# EAGLE design new_ATmega1280_breakout_smaller (EAGLE 5.11)
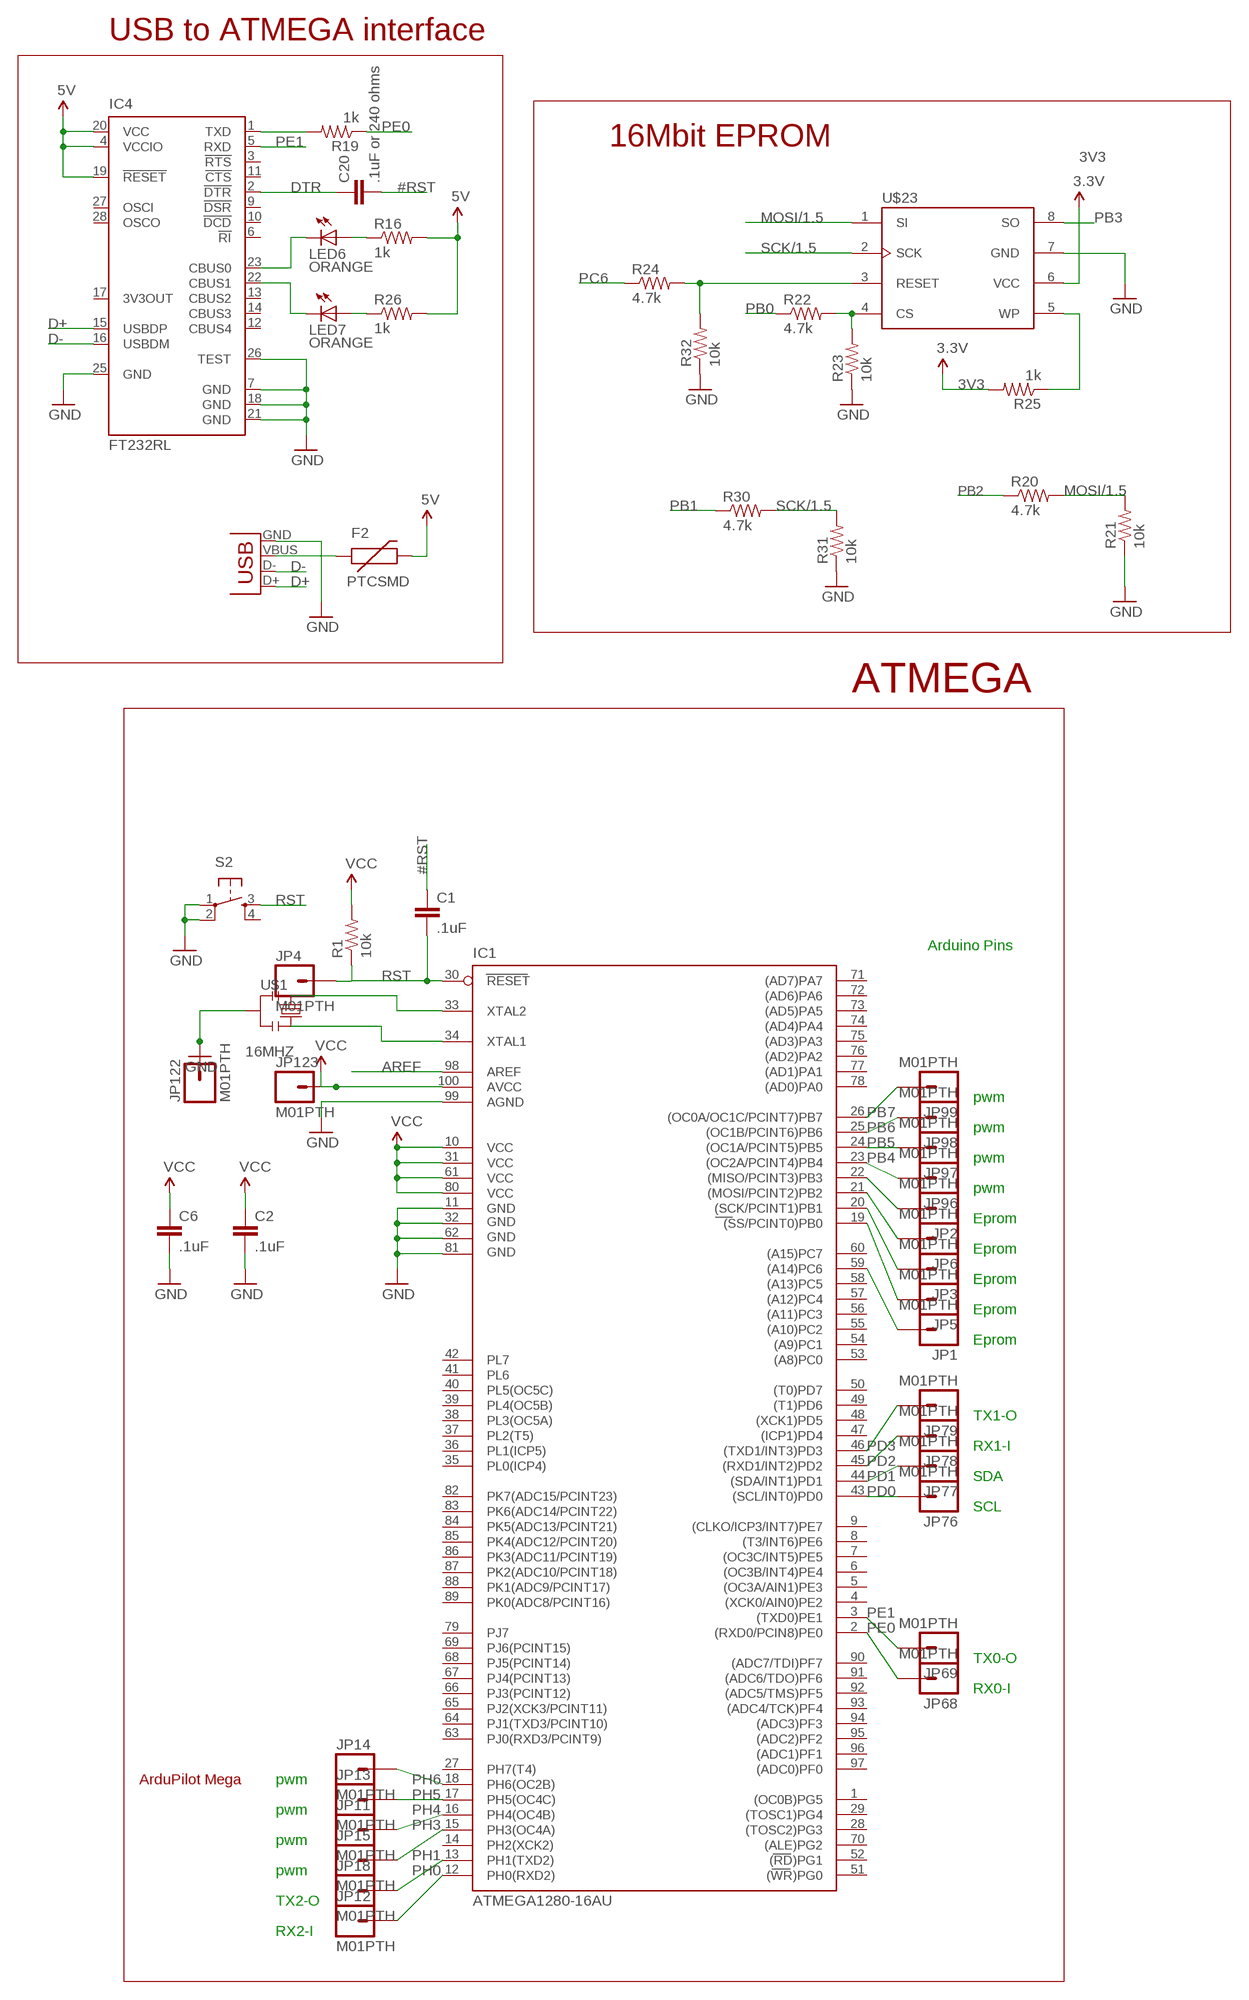
[diagram p0: schematic, sheet 1]

## Parts
C1  .1uF  CAP0402  [C0402]
C2  .1uF  CAP0402  [C0402]
C6  .1uF  CAP0402  [C0402]
C20  .1uF or 240 ohms  CAP0402  [C0402]
F2  PTCSMD  [PTC-1206]
IC1  ATMEGA1280-16AU  [TQFP100]
IC4  FT232RL  [SSOP28]
JP1  M01PTH  [1X01]
JP2  M01PTH  [1X01]
JP3  M01PTH  [1X01]
JP4  M01PTH  [1X01]
JP5  M01PTH  [1X01]
JP6  M01PTH  [1X01]
JP11  M01PTH  [1X01]
JP12  M01PTH  [1X01]
JP13  M01PTH  [1X01]
JP14  M01PTH  [1X01]
JP15  M01PTH  [1X01]
JP18  M01PTH  [1X01]
JP68  M01PTH  [1X01]
JP69  M01PTH  [1X01]
JP76  M01PTH  [1X01]
JP77  M01PTH  [1X01]
JP78  M01PTH  [1X01]
JP79  M01PTH  [1X01]
JP96  M01PTH  [1X01]
JP97  M01PTH  [1X01]
JP98  M01PTH  [1X01]
JP99  M01PTH  [1X01]
JP122  M01PTH  [1X01]
JP123  M01PTH  [1X01]
LED6  ORANGE  LED0603  [LED-0603]
LED7  ORANGE  LED0603  [LED-0603]
R1  10k  RESISTOR0402  [C0402]
R16  1k  RESISTOR0402  [C0402]
R19  1k  RESISTOR0402  [C0402]
R20  4.7k  RESISTOR0402  [C0402]
R21  10k  RESISTOR0402  [C0402]
R22  4.7k  RESISTOR0402  [C0402]
R23  10k  RESISTOR0402  [C0402]
R24  4.7k  RESISTOR0402  [C0402]
R25  1k  RESISTOR0402  [C0402]
R26  1k  RESISTOR0402  [C0402]
R30  4.7k  RESISTOR0402  [C0402]
R31  10k  RESISTOR0402  [C0402]
R32  10k  RESISTOR0402  [C0402]
S2  TAC_SWITCHSMD  [TACTILE_SWITCH_SMD]
U$1  16MHZ  RESONATORSMD  [RESONATOR-SMD]
U$23  DF  ATMEL_DATA_FLASH  [SO08WIDE]
X1  USBSMD  [USB-MINIB]

## Nets
3V3: R25.2 U$23.6(VCC) ; supply symbol labelled 3.3V
5V: F2.2
#RST: C1.1 C20.2
AREF: IC1.98(AREF)
D+: IC4.15(USBDP) X1.D+
D-: IC4.16(USBDM) X1.D-
DTR: C20.1 IC4.2(!DTR)
GND: C2.2 C6.2 IC1.11(GND) IC1.32(GND1) IC1.62(GND2) IC1.81(GND3) IC1.99(AGND) IC4.7(GND) IC4.18(GND) IC4.21(GND) IC4.25(GND) IC4.26(TEST) JP122.1 R21.1 R23.1 R31.1 R32.1 S2.1 S2.2 U$1.2 U$23.7(GND) X1.GND
MOSI/1.5: R20.2 R21.2 U$23.1(SI)
N$15: LED6.A R16.1
N$16: IC4.1(TXD) R19.2
N$17: F2.1 X1.VBUS
N$18: R22.2 R23.2 U$23.4(CS)
N$19: R24.2 R32.2 U$23.3(RESET)
N$22: LED7.A R26.1
N$24: IC4.23(CBUS0) LED6.C
N$25: IC4.22(CBUS1) LED7.C
N$56: IC1.34(XTAL1) U$1.3
N$89: IC1.33(XTAL2) U$1.1
PB0: IC1.19((SS/PCINT0)PB0) JP5.1 R22.1
PB1: IC1.20((SCK/PCINT1)PB1) JP3.1 R30.1
PB2: IC1.21((MOSI/PCINT2)PB2) JP6.1 R20.1
PB3: IC1.22((MISO/PCINT3)PB3) JP2.1 U$23.8(SO)
PB4: IC1.23((OC2A/PCINT4)PB4) JP96.1
PB5: IC1.24((OC1A/PCINT5)PB5) JP97.1
PB6: IC1.25((OC1B/PCINT6)PB6) JP98.1
PB7: IC1.26((OC0A/OC1C/PCINT7)PB7) JP99.1
PC6: IC1.59((A14)PC6) JP1.1 R24.1
PD0: IC1.43((SCL/INT0)PD0) JP76.1
PD1: IC1.44((SDA/INT1)PD1) JP77.1
PD2: IC1.45((RXD1/INT2)PD2) JP78.1
PD3: IC1.46((TXD1/INT3)PD3) JP79.1
PE0: IC1.2((RXD0/PCIN8)PE0) JP68.1 R19.1
PE1: IC1.3((TXD0)PE1) IC4.5(RXD) JP69.1
PH0: IC1.12(PH0(RXD2)) JP12.1
PH1: IC1.13(PH1(TXD2)) JP18.1
PH3: IC1.15(PH3(OC4A)) JP15.1
PH4: IC1.16(PH4(OC4B)) JP11.1
PH5: IC1.17(PH5(OC4C)) JP13.1
PH6: IC1.18(PH6(OC2B)) JP14.1
RST: C1.2 IC1.30(RESET) JP4.1 R1.1 S2.3
SCK/1.5: R30.2 R31.2 U$23.2(SCK)
VCC: C2.1 C6.1 IC1.10(VCC) IC1.31(VCC1) IC1.61(VCC2) IC1.80(VCC3) IC1.100(AVCC) IC4.4(VCCIO) IC4.19(!RESET) IC4.20(VCC) JP123.1 R1.2 R16.2 R26.2 ; supply symbol labelled 5V
WP: R25.1 U$23.5(WP)
Unconnected: IC1.1((OC0B)PG5) IC1.4((XCK0/AIN0)PE2) IC1.5((OC3A/AIN1)PE3) IC1.6((OC3B/INT4)PE4) IC1.7((OC3C/INT5)PE5) IC1.8((T3/INT6)PE6) IC1.9((CLKO/ICP3/INT7)PE7) IC1.14(PH2(XCK2)) IC1.27(PH7(T4)) IC1.28((TOSC2)PG3) IC1.29((TOSC1)PG4) IC1.35(PL0(ICP4)) IC1.36(PL1(ICP5)) IC1.37(PL2(T5)) IC1.38(PL3(OC5A)) IC1.39(PL4(OC5B)) IC1.40(PL5(OC5C)) IC1.41(PL6) IC1.42(PL7) IC1.47((ICP1)PD4) IC1.48((XCK1)PD5) IC1.49((T1)PD6) IC1.50((T0)PD7) IC1.51((WR)PG0) IC1.52((RD)PG1) IC1.53((A8)PC0) IC1.54((A9)PC1) IC1.55((A10)PC2) IC1.56((A11)PC3) IC1.57((A12)PC4) IC1.58((A13)PC5) IC1.60((A15)PC7) IC1.63(PJ0(RXD3/PCINT9)) IC1.64(PJ1(TXD3/PCINT10)) IC1.65(PJ2(XCK3/PCINT11)) IC1.66(PJ3(PCINT12)) IC1.67(PJ4(PCINT13)) IC1.68(PJ5(PCINT14)) IC1.69(PJ6(PCINT15)) IC1.70((ALE)PG2) IC1.71((AD7)PA7) IC1.72((AD6)PA6) IC1.73((AD5)PA5) IC1.74((AD4)PA4) IC1.75((AD3)PA3) IC1.76((AD2)PA2) IC1.77((AD1)PA1) IC1.78((AD0)PA0) IC1.79(PJ7) IC1.82(PK7(ADC15/PCINT23)) IC1.83(PK6(ADC14/PCINT22)) IC1.84(PK5(ADC13/PCINT21)) IC1.85(PK4(ADC12/PCINT20)) IC1.86(PK3(ADC11/PCINT19)) IC1.87(PK2(ADC10/PCINT18)) IC1.88(PK1(ADC9/PCINT17)) IC1.89(PK0(ADC8/PCINT16)) IC1.90((ADC7/TDI)PF7) IC1.91((ADC6/TDO)PF6) IC1.92((ADC5/TMS)PF5) IC1.93((ADC4/TCK)PF4) IC1.94((ADC3)PF3) IC1.95((ADC2)PF2) IC1.96((ADC1)PF1) IC1.97((ADC0)PF0) IC4.3(!RTS) IC4.6(!RI) IC4.9(!DSR) IC4.10(!DCD) IC4.11(!CTS) IC4.12(CBUS4) IC4.13(CBUS2) IC4.14(CBUS3) IC4.17(3V3OUT) IC4.27(OSCI) IC4.28(OSCO) S2.4

## Notes on the sheet
- USB to ATMEGA interface
- 16Mbit EPROM
- ATMEGA
- Arduino Pins
- pwm
- pwm
- pwm
- pwm
- Eprom
- Eprom
- Eprom
- Eprom
- Eprom
- TX1-O
- RX1-I
- SDA
- SCL
- TX0-O
- RX0-I
- ArduPilot Mega | pwm
- pwm
- pwm
- pwm
- TX2-O
- RX2-I

## Library data of the parts
C1 C2 C6 C20 = DIYdrones3:CAP: Capacitor Standard 0603 ceramic capacitor, and 0.1" leaded capacitor.
F2 = DIYdrones3:PTC: Resettable Fuse PTC Resettable Fuse. Spark Fun Electronics SKU : COM-08357
IC1 = atmel-2010:ATMEGA*: MICROCONTROLLER 64/128/256 Kbytes FLASH 4 Kbytes EEPROM 8 Kbytes SRAM 86 General Purpose I/O pins 12-channels16-bit PWM 4 x Serial USARTs 16-channels 10-bit A/D
IC4 = ftdichip:FT232R: Source: http://www.ftdichip.com/Documents/DataSheets/DS_FT232R_v104.pdf
JP1-JP6 JP11-JP15 JP18 JP68 JP69 JP76-JP79 JP96-JP99 JP122 JP123 = DIYdrones3:M01: Header 1 Standard 1-pin 0.1" header. Use with straight break away headers (SKU : PRT-00116), right angle break away headers (PRT-00553), swiss pins (PRT-00743), machine pins (PRT-00117), and female headers (PRT-00115).
LED6 LED7 = DIYdrones3:LED: LEDs Standard schematic elements and footprints for 5mm, 3mm, 1206, and 0603 sized LEDs. 5mm - Spark Fun Electronics SKU : COM-00529 (and others)
R1 R16 R19-R26 R30-R32 = DIYdrones3:RESISTOR: Resistor Basic schematic elements and footprints for 0603, 1206, and PTH 1/10th watt (small) resistors.
S2 = SparkFun:TAC_SWITCH: Momentary Switch Button commonly used for reset or general input. Spark Fun Electronics SKU : COM-00097
U$1 = DIYdrones3:RESONATOR: Resonator Small SMD resonator. This is the itty bitty 10/20MHz resonators with built in caps. CSTCE10M0G55 and CSTCE20M0V53. Footprint has been reviewed closely but hasn't been tested yet.
U$23 = DIYdrones3:ATMEL_DATA_FLASH: 16Mbit EEPROM DataFlash Footprint needs touching up. Spark Fun Electronics SKU : COM-00301
X1 = DIYdrones3:USB: USB Connectors USB-B-PTH is fully proven SKU : PRT-00139 USB-miniB is fully proven SKU : PRT-00587 USB-A-PCB is untested. USB-A-H is throughly reviewed, but untested. Spark Fun Electronics SKU : PRT-00437 USB-B-SMT is throughly reviewed, but untested. Needs silkscreen touching up. USB-A-S has not been used/tested USB-MB-H has not been used/tested

## Board
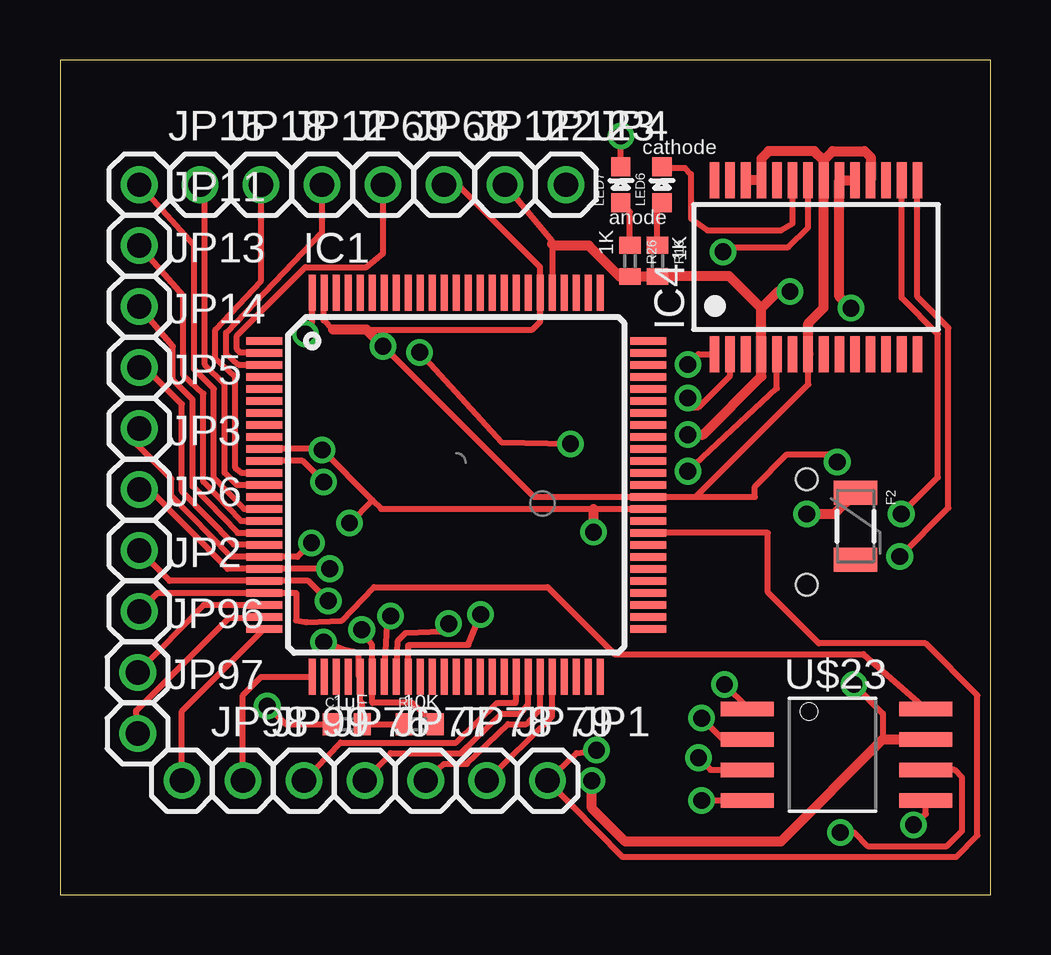
[diagram p1: board, top side]
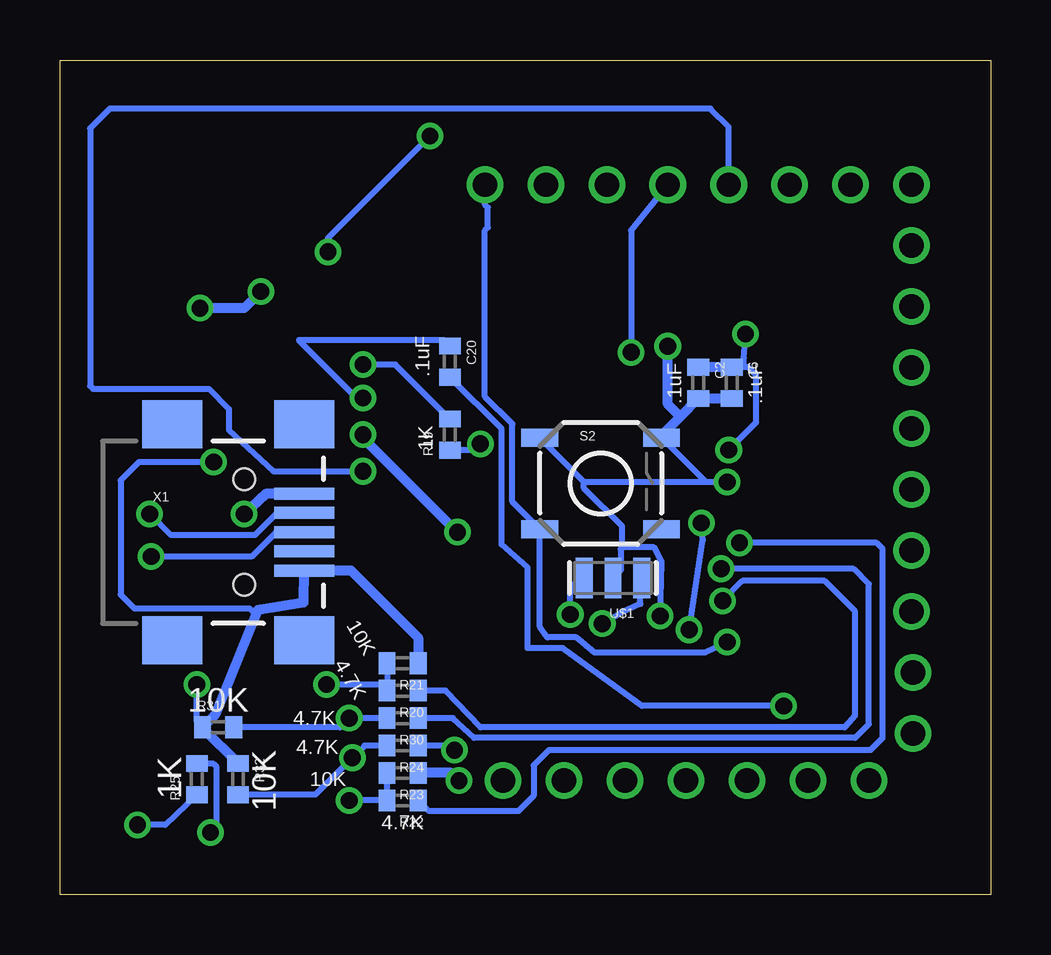
[diagram p2: board, bottom side, seen from below]

Size 38.79 x 34.79 mm. Coordinates in mm from the lower left corner, seen from the top.
Outline: 0,0 38.79,0 38.79,34.79 0,34.79 0,0
Copper layers (1*16): Top 0.0356mm / dielectric 1.5011mm / Bottom 0.0356mm
Design rules "typical_4pcb": minimum track width 10mil, minimum drill 15mil, track to track 6mil, track to pad 6mil, pad to pad 6mil, via to via 6mil, smd to smd 6mil, copper to edge 15mil, drill to drill 8mil, minimum pad ring 10mil, minimum via ring 8mil, stop-mask expansion 4mil, vias tented up to drill 0mil, thermal gap 10mil

### Footprints (pad centres in the part's own frame; a part is rotated, then mirrored left to right if it is on the bottom)
C0402 = smd 0.7 x 0.9: 1 -0.65,0; 2 0.65,0
PTC-1206 = smd 1 x 1.8: 1 -1.4,0; 2 1.4,0
TQFP100 = smd 1.5 x 0.3: 1 -8,6; 2 -8,5.5; 3 -8,5; 4 -8,4.5; 5 -8,4; 6 -8,3.5; 7 -8,3; 8 -8,2.5; 9 -8,2; 10 -8,1.5; 11 -8,1; 12 -8,0.5; 13 -8,0; 14 -8,-0.5; 15 -8,-1; 16 -8,-1.5; 17 -8,-2; 18 -8,-2.5; 19 -8,-3; 20 -8,-3.5; 21 -8,-4; 22 -8,-4.5; 23 -8,-5; 24 -8,-5.5; 25 -8,-6; 51 8,-6; 52 8,-5.5; 53 8,-5; 54 8,-4.5; 55 8,-4; 56 8,-3.5; 57 8,-3; 58 8,-2.5; 59 8,-2; 60 8,-1.5; 61 8,-1; 62 8,-0.5; 63 8,0; 64 8,0.5; 65 8,1; 66 8,1.5; 67 8,2; 68 8,2.5; 69 8,3; 70 8,3.5; 71 8,4; 72 8,4.5; 73 8,5; 74 8,5.5; 75 8,6 | smd 0.3 x 1.5: 26 -6,-8; 27 -5.5,-8; 28 -5,-8; 29 -4.5,-8; 30 -4,-8; 31 -3.5,-8; 32 -3,-8; 33 -2.5,-8; 34 -2,-8; 35 -1.5,-8; 36 -1,-8; 37 -0.5,-8; 38 0,-8; 39 0.5,-8; 40 1,-8; 41 1.5,-8; 42 2,-8; 43 2.5,-8; 44 3,-8; 45 3.5,-8; 46 4,-8; 47 4.5,-8; 48 5,-8; 49 5.5,-8; 50 6,-8; 76 6,8; 77 5.5,8; 78 5,8; 79 4.5,8; 80 4,8; 81 3.5,8; 82 3,8; 83 2.5,8; 84 2,8; 85 1.5,8; 86 1,8; 87 0.5,8; 88 0,8; 89 -0.5,8; 90 -1,8; 91 -1.5,8; 92 -2,8; 93 -2.5,8; 94 -3,8; 95 -3.5,8; 96 -4,8; 97 -4.5,8; 98 -5,8; 99 -5.5,8; 100 -6,8
SSOP28 = smd 0.4 x 1.5: 1 -4.225,-3.625; 2 -3.575,-3.625; 3 -2.925,-3.625; 4 -2.275,-3.625; 5 -1.625,-3.625; 6 -0.975,-3.625; 7 -0.325,-3.625; 8 0.325,-3.625; 9 0.975,-3.625; 10 1.625,-3.625; 11 2.275,-3.625; 12 2.925,-3.625; 13 3.575,-3.625; 14 4.225,-3.625; 15 4.225,3.625; 16 3.575,3.625; 17 2.925,3.625; 18 2.275,3.625; 19 1.625,3.625; 20 0.975,3.625; 21 0.325,3.625; 22 -0.325,3.625; 23 -0.975,3.625; 24 -1.625,3.625; 25 -2.275,3.625; 26 -2.925,3.625; 27 -3.575,3.625; 28 -4.225,3.625
1X01 = drill 1.016 round: 1 0,0
LED-0603 = smd 0.8 x 0.8: A 0,-0.75; C 0,0.75
TACTILE_SWITCH_SMD = smd 1.524 x 0.762: 1 -2.54,1.905; 2 2.54,1.905; 3 -2.54,-1.905; 4 2.54,-1.905
RESONATOR-SMD = smd 0.7 x 1.7: 1 -1.2,0; 2 0,0; 3 1.2,0
SO08WIDE = smd 0.61 x 2.21: 1 -1.905,-3.569; 2 -0.635,-3.569; 3 0.635,-3.569; 4 1.905,-3.569; 5 1.905,3.886; 6 0.635,3.886; 7 -0.635,3.886; 8 -1.905,3.886
USB-MINIB = smd 2.5 x 0.5: D+ 2.5,0; D- 2.5,0.8; GND 2.5,-1.6; ID 2.5,-0.8; VBUS 2.5,1.6 | smd 2.5 x 2: GND@1 -3,-4.5; GND@2 -3,4.5; GND@3 2.5,4.5; GND@4 2.5,-4.5 | hole 0.9: 0,2.2; 0,-2.2

### Placement (x,y rotation side)
C1  11.94,7.11 0 top
C2  12.19,21.34 270 bottom
C6  10.79,21.34 270 bottom
C20  22.54,22.23 270 bottom
F2  33.15,15.37 270 top
IC1  16.51,17.08 0 top
IC4  31.5,26.16 0 top
JP1  20.32,4.76 0 top
JP2  3.3,11.81 0 top
JP3  3.3,16.89 0 top
JP4  21.08,29.59 0 top
JP5  3.3,19.43 0 top
JP6  3.3,14.35 0 top
JP11  3.3,27.05 0 top
JP12  8.38,29.59 0 top
JP13  3.3,24.51 0 top
JP14  3.3,21.97 0 top
JP15  3.3,29.59 0 top
JP18  5.84,29.59 0 top
JP68  13.46,29.59 0 top
JP69  10.92,29.59 0 top
JP76  10.16,4.76 0 top
JP77  12.7,4.76 0 top
JP78  15.24,4.76 0 top
JP79  17.78,4.76 0 top
JP96  3.24,9.27 0 top
JP97  3.24,6.73 0 top
JP98  5.08,4.76 0 top
JP99  7.62,4.76 0 top
JP122  16,29.59 0 top
JP123  18.54,29.59 0 top
LED6  25.08,29.59 0 top
LED7  23.37,29.59 0 top
R1  14.99,7.11 0 top
R16  24.89,26.42 270 top
R19  22.54,19.18 90 bottom
R20  24.51,8.51 180 bottom
R21  24.51,9.65 180 bottom
R22  24.51,3.94 180 bottom
R23  24.51,5.08 180 bottom
R24  24.51,6.22 180 bottom
R25  33.08,4.83 90 bottom
R26  23.75,26.42 270 top
R30  24.51,7.37 180 bottom
R31  32.19,6.99 0 bottom
R32  31.37,4.83 270 bottom
S2  16.26,17.14 0 bottom
U$1  15.75,13.21 180 bottom
U$23  32.19,5.84 270 top
X1  31.11,15.11 0 bottom

### Tracks (layer width: path | path; a pad name or v marks a point on that pad's centre or on a via)
3V3  (via drill 0.7)
  Top 0.254: U$23.6 37.27,5.21 37.59,4.89 37.59,2.67 36.96,2.03 33.66,2.03 33.08,2.6 v32.51,2.6
  Bottom 0.254: 33.35,5.21 R25.2 33.07,5.46 32.38,5.46 32.26,5.33 32.26,2.86 v32.51,2.6
#RST  (via drill 0.7)
  Top 0.254: C1.1 9.4,7.11 v8.64,7.87
  Bottom 0.254: v8.64,7.87 14.54,7.87 17.84,10.29 19.3,10.29 19.3,13.65 20.38,14.61 20.38,19.42 C20.2
D+  (via drill 0.7)
  Top 0.254: IC4.15 35.72,24.92 37.02,23.62 37.02,16.13 v34.99,14.1
  Bottom 0.254: v34.99,14.1 30.8,14.1 29.78,15.11 X1.D+
D-  (via drill 0.7)
  Top 0.254: IC4.16 35.07,24.87 36.58,23.37 36.58,17.4 v35.05,15.88
  Bottom 0.254: v35.05,15.88 34.16,14.99 30.67,14.99 29.74,15.91 X1.D-
DTR  (via drill 0.7)
  Top 0.254: IC4.2 27.92,21.63 26.61,20.32 26.35,20.32 v26.16,20.7
  Bottom 0.254: v26.16,20.7 26.48,20.77 28.83,23.11 22.78,23.11 C20.1
GND  (via drill 0.7)
  Top 0.254: JP122.1 16.7,29.46 20,26.16 IC1.81 | IC1.81 | IC1.81 20,23.88 19.68,23.56 11.37,23.56 10.99,23.94 10.99,25.06 IC1.99 | IC1.11 10.11,18.08 v10.99,17.21 | 25.73,16.58 IC1.62 19.74,16.58 v13.46,22.86 | 26.49,16.58 31.18,21.27 IC4.7 | 25.73,16.58 26.49,16.58 | 25.73,16.58 25.72,16.57 | 34.29,6.48 34.29,7.56 v33.08,8.76 | 26.49,16.58 28.95,16.58 28.95,17.01 30.29,18.35 32.19,18.35 v32.38,18.03 | IC1.32 13.64,11.22 v13.78,11.62
  Top 0.406: 11.37,23.56 12.76,23.56 v13.46,22.86 | IC4.7 31.18,23.81 31.82,24.45 IC4.21 31.81,30.61 | IC4.26 IC4.25 29.22,30.68 29.53,30.99 31.43,30.99 31.81,30.61 | IC4.18 33.77,30.75 33.53,30.99 32.19,30.99 31.81,30.61 | v22.16,4.76 22.16,3.62 23.56,2.22 30.04,2.22 34.29,6.48 U$23.7
  Bottom 0.254: 11.87,17.21 v10.99,17.21 | 11.87,17.21 S2.2 | 16.95,17.21 11.87,17.21 | 16.95,17.21 S2.1 | 16.95,17.21 16.95,16.95 15.37,15.37 15.37,14.48 | v33.08,8.76 33.08,7.22 R31.1 | v32.38,18.03 35.5,18.03 36.26,17.27 36.26,12.51 35.69,11.94 30.89,11.94 30.62,11.68 | v13.78,11.62 13.72,13.84 14.03,14.48 15.37,14.48 | 15.37,14.48 15.43,14.41 15.43,13.53 U$1.2
  Bottom 0.406: S2.2 13.72,19.16 12.95,19.93 | 12.95,19.93 C2.2 C6.2 | v13.46,22.86 13.46,20.45 12.95,19.93 | 28.6,13.53 26.67,13.53 23.86,10.72 R21.1 | 28.6,13.53 X1.GND | R23.1 22.48,5.08 v22.16,4.76 | R32.1 32.84,6.95 R31.1 32.32,7.51 30.62,11.68 30.54,11.87 30.43,11.89 28.64,12.19 28.6,13.53
MOSI/1.5  (via drill 0.7)
  Top 0.254: U$23.1 28.63,7.82 v27.69,8.76
  Bottom 0.254: R21.2 R20.2 25.41,8.76 v27.69,8.76
N$15
  Top 0.254: R16.1 24.89,28.65 LED6.A
N$16  (via drill 0.7)
  Top 0.254: IC4.1 26.6,22.54 v26.16,22.1
  Bottom 0.254: v26.16,22.1 24.81,22.1 R19.2
N$17  (via drill 0.7)
  Top 0.406: v31.11,15.88 32.26,15.88 F2.1
  Bottom 0.406: X1.VBUS 30.21,16.71 v31.11,15.88
N$18  (via drill 0.7)
  Top 0.254: v26.73,3.94 U$23.4
  Bottom 0.254: v26.73,3.94 R22.2 R23.2
N$19  (via drill 0.7)
  Top 0.254: U$23.3 27.11,5.21 v26.61,5.71
  Bottom 0.254: R24.2 26.1,6.22 v26.61,5.71 28.14,4.18 R32.2
N$22
  Top 0.254: R26.1 23.75,28.46 LED7.A
N$24
  Top 0.254: IC4.23 30.52,27.98 30.04,27.69 26.99,27.69 26.29,28.19 26.29,30.04 26.04,30.29 25.13,30.29 LED6.C
N$25  (via drill 0.7)
  Top 0.254: IC4.22 31.17,27.8 30.35,26.99 27.88,26.99 v27.62,26.8 | LED7.C v23.37,31.62
  Bottom 0.254: v27.62,26.8 27.62,27.37 v23.37,31.62
N$56  (via drill 0.7)
  Top 0.254: IC1.34 14.51,10.38 14.54,10.41 17.02,10.41 v17.53,11.68
  Bottom 0.254: U$1.3 17.53,12.88 v17.53,11.68
N$89  (via drill 0.7)
  Top 0.254: IC1.33 14.07,10.58 14.41,10.92 15.94,10.99 v16.19,11.3
  Bottom 0.254: v16.19,11.3 15.43,11.75 14.61,12.13 14.61,13.15 U$1.1
PB0  (via drill 0.7)
  Top 0.254: JP5.1 3.05,18.92 4.64,17.34 4.64,16.64 7.11,14.1 8.49,14.1 IC1.19 9.89,14.08 v10.48,14.67
  Bottom 0.254: v10.48,14.67 4.76,14.67 4.51,14.41 4.51,6.54 5.02,6.03 18.41,6.03 19.05,5.4 19.05,4.13 19.68,3.49 23.42,3.49 R22.1
PB1  (via drill 0.7)
  Top 0.254: JP3.1 3.75,16.89 6.99,13.59 IC1.20 10.91,13.58 v11.24,13.59
  Bottom 0.254: v11.24,13.59 5.71,13.59 5.08,12.95 5.08,7.11 5.65,6.54 21.53,6.54 22.42,7.37 R30.1
PB2  (via drill 0.7)
  Top 0.254: JP6.1 4.57,13.08 IC1.21 10.35,13.08 v11.18,12.26
  Bottom 0.254: R20.1 22.73,8.51 21.27,6.99 6.1,6.99 5.65,7.49 5.65,11.81 6.92,13.08 10.35,13.08 v11.18,12.26
PB3
  Top 0.254: JP2.1 4.07,12.58 IC1.22 9.83,12.58 9.83,11.44 10.29,11.37 11.75,11.43 13.08,12.83 20.32,12.83 23.11,10.03 33.48,10.03 U$23.8
PB4
  Top 0.254: JP96.1 5.99,12.08 IC1.23
PB5
  Top 0.254: JP97.1 3.17,7.68 7.05,11.56 8.49,11.56 IC1.24
PB6
  Top 0.254: JP98.1 5.08,7.65 IC1.25
PB7
  Top 0.254: IC1.26 8.38,9.08 7.62,8.32 JP99.1
PC6  (via drill 0.7)
  Top 0.254: v22.35,6.03 21.53,5.91 JP1.1 23.43,1.59 37.34,1.59 38.23,2.48 38.23,8.32 36.07,10.48 31.62,10.48 29.5,12.61 29.5,15.08 IC1.59
  Bottom 0.254: R24.1 22.67,6.22 v22.35,6.03
PD0
  Top 0.254: JP76.1 11.68,6.35 16.51,6.35 18.22,8 18.99,8 19.01,8.09 IC1.43
PD1
  Top 0.254: JP77.1 13.78,5.91 16.7,5.91 18.41,7.56 19.18,7.56 19.51,7.95 IC1.44
PD2
  Top 0.254: JP78.1 16,5.46 16.95,5.46 18.67,7.11 19.43,7.11 20.01,7.75 IC1.45
PD3
  Top 0.254: JP79.1 20.51,7.43 IC1.46
PE0  (via drill 0.7)
  Top 0.254: JP68.1 13.46,26.73 12.76,26.16 10.22,26.16 7.37,23.3 7.37,22.73 7.49,22.61 8.49,22.61 IC1.2 | v21.27,18.8 18.41,18.86 v14.99,22.61
  Bottom 0.254: R19.1 21.54,18.53 v21.27,18.8 | v14.99,22.61 14.99,27.69 JP68.1
PE1  (via drill 0.7)
  Top 0.254: JP69.1 10.92,27.62 6.92,23.43 6.92,22.54 7.43,22.1 8.49,22.1 IC1.3 | IC4.5 29.87,21.11 v26.16,17.65
  Bottom 0.254: v26.16,17.65 29.91,17.65 31.75,19.37 31.75,20.26 32.58,21.08 37.4,21.08 37.53,21.21 37.53,31.94 36.7,32.77 11.68,32.77 10.92,32 JP69.1
PH0
  Top 0.254: JP12.1 8.38,25.59 6.48,23.56 6.48,22.35 7.3,21.59 7.3,17.78 7.56,17.59 IC1.12
PH1
  Top 0.254: JP18.1 6.03,29.15 6.03,22.1 6.86,21.27 6.86,17.59 7.37,17.08 IC1.13
PH3
  Top 0.254: JP15.1 5.59,27.05 5.59,21.91 6.41,21.08 6.41,17.4 7.67,16.08 IC1.15
PH4
  Top 0.254: JP11.1 5.14,24.96 5.14,21.65 5.97,20.89 5.97,17.21 7.53,15.58 IC1.16
PH5
  Top 0.254: JP13.1 4.7,22.86 4.7,21.46 5.52,20.64 5.52,17.02 7.4,15.08 IC1.17
PH6
  Top 0.254: JP14.1 3.56,21.97 5.08,20.45 5.08,16.83 7.24,14.61 8.49,14.61 IC1.18
RST  (via drill 0.7)
  Top 0.254: R1.1 C1.2 12.59,7.99 12.51,8.06 IC1.30 12.45,9.15 12.45,10.03 12.38,10.1 11.81,10.22 v10.99,10.54
  Bottom 0.254: JP4.1 21.08,28.77 20.95,28.64 20.95,27.81 21.08,27.69 21.08,20.77 19.94,19.62 19.94,16.38 S2.3 18.8,11.18 18.48,10.73 17.27,10.73 16.51,10.1 11.94,10.1 v10.99,10.54
SCK/1.5  (via drill 0.7)
  Top 0.254: U$23.2 27.62,6.48 v26.73,7.37
  Bottom 0.254: R30.2 v26.73,7.37 27.11,6.99 R31.2
VCC  (via drill 0.7)
  Top 0.254: JP123.1 20.51,27.24 20.51,27.11 IC1.80 | R1.2 14.68,8 13.02,8 13.01,8.07 IC1.31 13.01,10.42 v12.57,11.05 | IC1.10 10.88,18.58 v10.92,18.54 13.02,16.45 | IC1.61 22.23,16.08 13.38,16.08 13.02,16.45 | IC1.100 10.51,23.84 v10.22,23.37 | v12.06,15.49 13.02,16.45
  Top 0.406: 20.51,27.11 20.57,27.05 22.04,27.05 23.32,25.77 R26.2 R16.2 24.91,25.78 27.88,25.78 29.22,24.44 | 29.22,24.44 IC4.4 29.22,21.6 26.8,19.18 v26.16,19.18 | IC4.19 IC4.20 32.47,24.93 v32.96,24.45 | v30.42,25.15 29.93,25.15 29.22,24.44 | 22.23,16.08 v22.23,15.11
  Bottom 0.254: v10.92,18.54 9.78,19.68 9.78,21.65 10.11,21.99 10.29,21.99 | 10.29,21.99 C6.1 | v10.22,23.37 10.29,22.37 10.29,21.99 | v12.57,11.05 12,14.8 v12.06,15.49 | 26.16,19.05 v26.16,19.18
  Bottom 0.406: C6.1 C2.1 | v32.96,24.45 31.11,24.45 v30.42,25.15 | v22.23,15.11 26.16,19.05
WP  (via drill 0.7)
  Top 0.254: U$23.5 36.08,3.38 v35.56,2.92
  Bottom 0.254: v35.56,2.92 34.4,2.92 R25.1

### Text on the board
tPlace: cathode | anode | 1K | 1K | .1uF | 10K
bPlace: .1uF | .1uF | .1uF | 1K | 10K | 4.7K | 4.7K | 10K | 4.7K | 10K | 1K | 4.7K | 10K